# Altium schematic sheet Gyroscope.SchDoc: Gyroscope Schematic
size A; Author: Jason Popich, Tucker Peyok, Ross White; DocumentNumber: N/A; Revision: 001; SheetNumber: 4; SheetTotal: 4
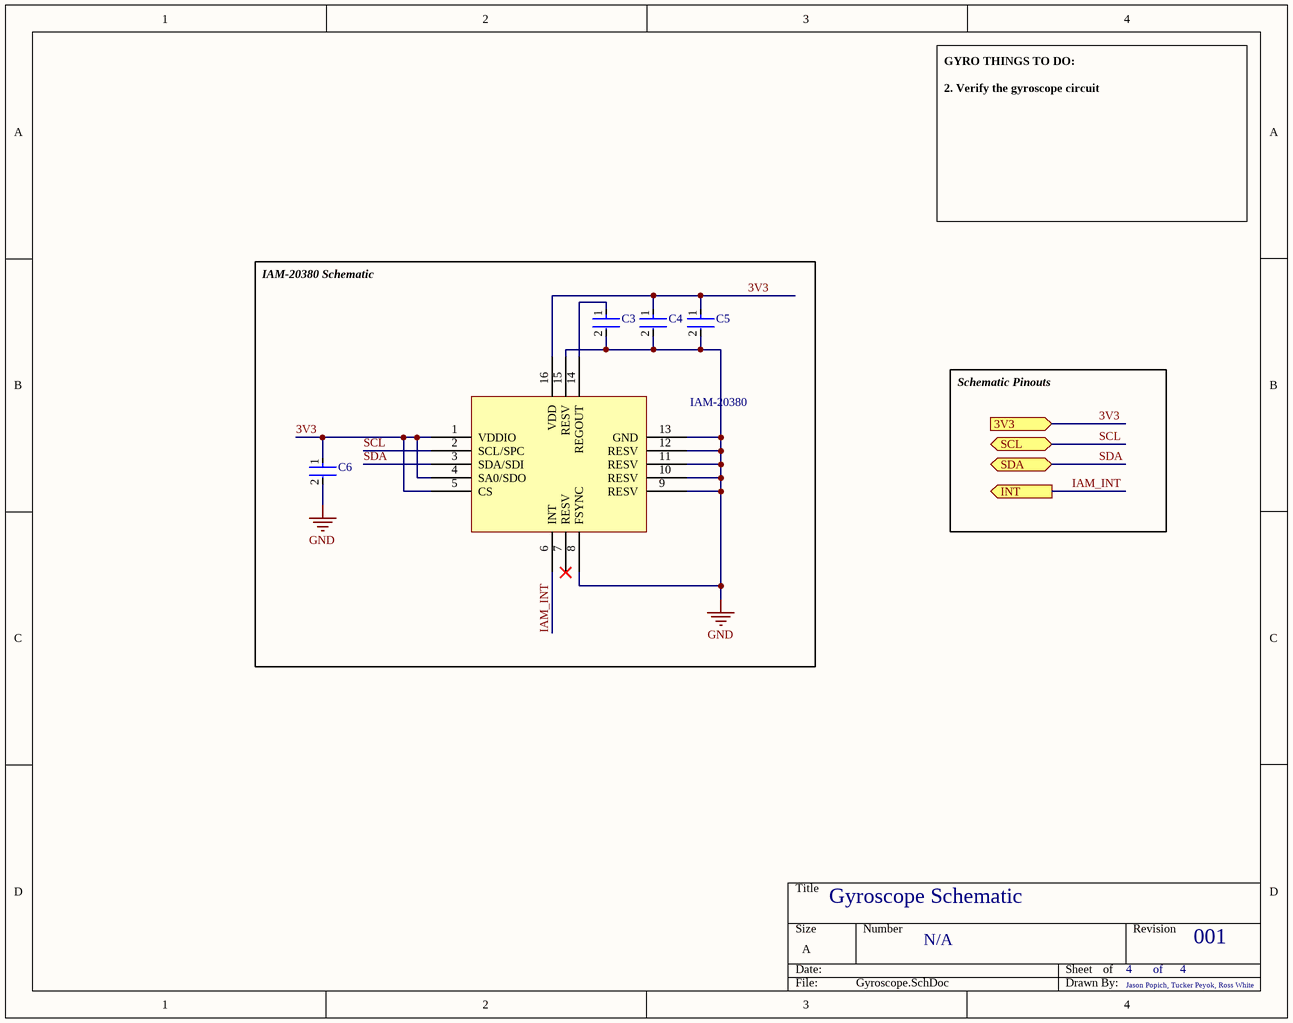
[diagram p0: Gyroscope.SchDoc]

## Parts
*  IAM-20380  [Gyro - IAM20380]
C3  GJ821BR71H105KA12L  [FP-GJ821B-0_1-MFG]  (value not drawn)
C4  GJ821BR71H105KA12L  [FP-GJ821B-0_1-MFG]  (value not drawn)
C5  GJ821BR71H105KA12L  [FP-GJ821B-0_1-MFG]  (value not drawn)
C6  GCJ21BR72E103KXJ3L  [FP-GCJ21B-0_2-MFG]  (value not drawn)

## Blocks framed on the sheet
IAM-20380 Schematic: * C3-C6

## Ports
3V3 (in, see Main_Sheet[3B], Accelerometer[3B], Microcontroller[4B]), INT (out, see Main_Sheet[3B]), SCL (bidir, see Main_Sheet[3B], Microcontroller[4B]), SDA (bidir, see Main_Sheet[3B], Microcontroller[4B])

## Nets
GND: *.8(FSYNC) *.9(RESV) *.10(RESV) *.11(RESV) *.12(RESV) *.13(GND) *.15(RESV) C3.2 C4.2 C5.2 C6.2
3V3: *.1(VDDIO) *.4(SA0/SDO) *.5(CS) *.16(VDD) C4.1 C5.1 C6.1 ; port 3V3
IAM_INT: *.6(INT) ; port INT
SCL: *.2(SCL/SPC) ; port SCL
SDA: *.3(SDA/SDI) ; port SDA
Net*_14: *.14(REGOUT) C3.1

Not connected (* = marked no-connect by the designer): * 7(RESV)*

## Notes on the sheet
- GYRO THINGS TO DO:
  2. Verify the gyroscope circuit
- Schematic Pinouts
- of

## Library data of the parts
* = IAM-20380: IAM-20380 High Performance Gyroscope
C3-C5 = CMP-06035-063015-1: CAP CER 1UF 50V X7R 0805; Tolerance: 10%; Dielectric: X7R; Length: 2mm; Voltage Rating (DC): 50V; Case/Package: 0805; Max Operating Temperature: 125°C; Min Operating Temperature: -55°C; Capacitance: 1uF; Depth: 1.25mm; Packaging: Tape and Reel
C6 = CMP-2007-03220-2: CAP CER 10000PF 250V X7R 0805; Capacitance: 10nF; Tolerance: 10%; Ratings: AEC-Q200; Width: 0.049inch; Length: 0.079inch; Voltage Rating: 250V; Min Operating Temperature: -55°C; Thickness: 0.057inch; Packaging: Tape and Reel; Case/Package: 0805; Case Code (Metric): 2012; Case Code (Imperial): 0805; Max Operating Temperature: 125°C; Voltage Rating (DC): 250V; REACH SVHC: No SVHC; Dielectric: X7R; Termination: SMD/SMT; Mount: Surface Mount; Features: Soft Termination; Package Quantity: 3000